# EAGLE schematic Bottom PCB Schematic (EAGLE 9.7.0)
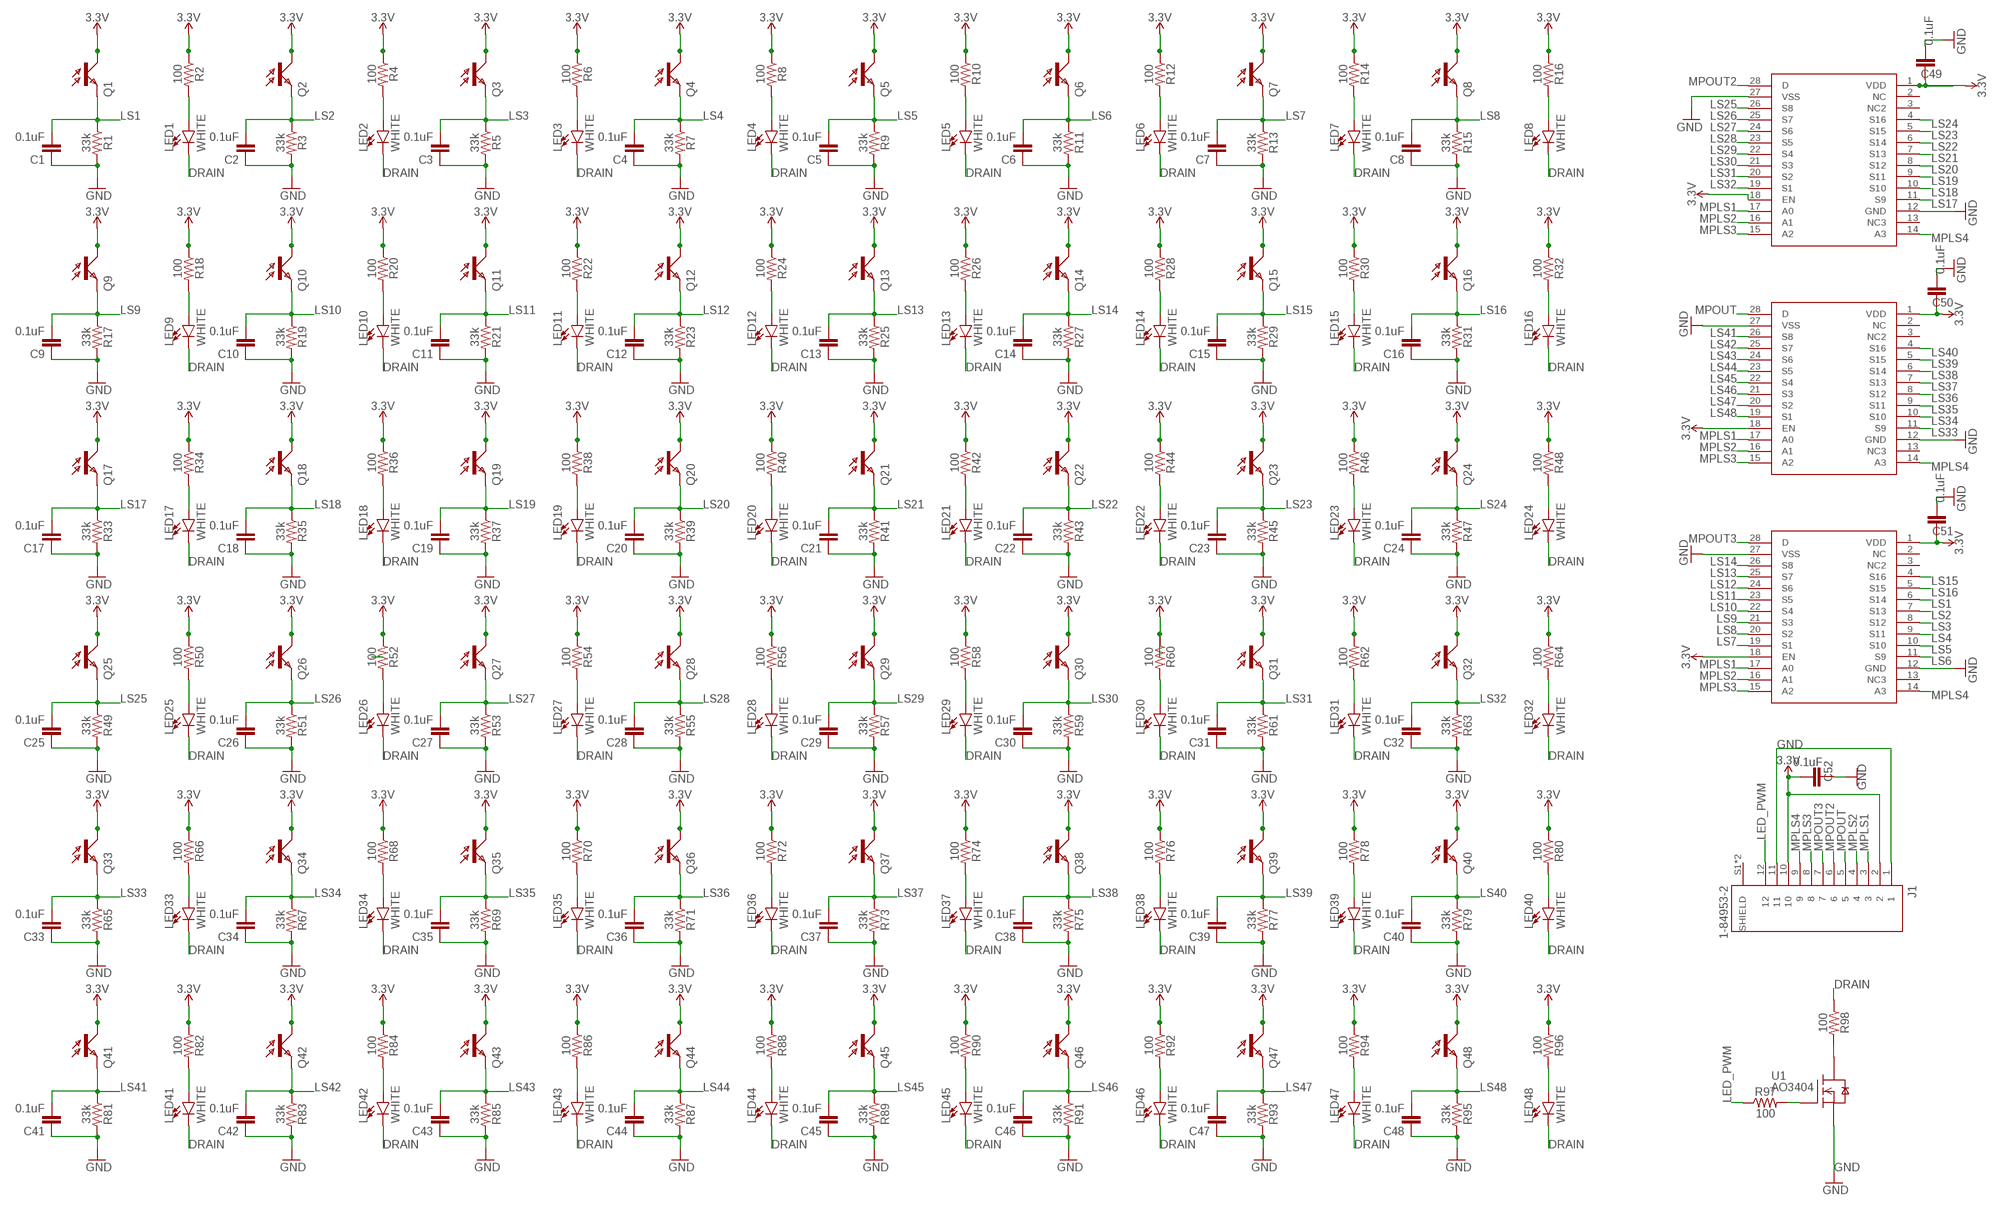
[diagram p0: schematic, sheet 1]

## Parts
C1  0.1uF  0.8PF-0402-50V-0.1PF  [0402]
C2  0.1uF  0.8PF-0402-50V-0.1PF  [0402]
C3  0.1uF  0.8PF-0402-50V-0.1PF  [0402]
C4  0.1uF  0.8PF-0402-50V-0.1PF  [0402]
C5  0.1uF  0.8PF-0402-50V-0.1PF  [0402]
C6  0.1uF  0.8PF-0402-50V-0.1PF  [0402]
C7  0.1uF  0.8PF-0402-50V-0.1PF  [0402]
C8  0.1uF  0.8PF-0402-50V-0.1PF  [0402]
C9  0.1uF  0.8PF-0402-50V-0.1PF  [0402]
C10  0.1uF  0.8PF-0402-50V-0.1PF  [0402]
C11  0.1uF  0.8PF-0402-50V-0.1PF  [0402]
C12  0.1uF  0.8PF-0402-50V-0.1PF  [0402]
C13  0.1uF  0.8PF-0402-50V-0.1PF  [0402]
C14  0.1uF  0.8PF-0402-50V-0.1PF  [0402]
C15  0.1uF  0.8PF-0402-50V-0.1PF  [0402]
C16  0.1uF  0.8PF-0402-50V-0.1PF  [0402]
C17  0.1uF  0.8PF-0402-50V-0.1PF  [0402]
C18  0.1uF  0.8PF-0402-50V-0.1PF  [0402]
C19  0.1uF  0.8PF-0402-50V-0.1PF  [0402]
C20  0.1uF  0.8PF-0402-50V-0.1PF  [0402]
C21  0.1uF  0.8PF-0402-50V-0.1PF  [0402]
C22  0.1uF  0.8PF-0402-50V-0.1PF  [0402]
C23  0.1uF  0.8PF-0402-50V-0.1PF  [0402]
C24  0.1uF  0.8PF-0402-50V-0.1PF  [0402]
C25  0.1uF  0.8PF-0402-50V-0.1PF  [0402]
C26  0.1uF  0.8PF-0402-50V-0.1PF  [0402]
C27  0.1uF  0.8PF-0402-50V-0.1PF  [0402]
C28  0.1uF  0.8PF-0402-50V-0.1PF  [0402]
C29  0.1uF  0.8PF-0402-50V-0.1PF  [0402]
C30  0.1uF  0.8PF-0402-50V-0.1PF  [0402]
C31  0.1uF  0.8PF-0402-50V-0.1PF  [0402]
C32  0.1uF  0.8PF-0402-50V-0.1PF  [0402]
C33  0.1uF  0.8PF-0402-50V-0.1PF  [0402]
C34  0.1uF  0.8PF-0402-50V-0.1PF  [0402]
C35  0.1uF  0.8PF-0402-50V-0.1PF  [0402]
C36  0.1uF  0.8PF-0402-50V-0.1PF  [0402]
C37  0.1uF  0.8PF-0402-50V-0.1PF  [0402]
C38  0.1uF  0.8PF-0402-50V-0.1PF  [0402]
C39  0.1uF  0.8PF-0402-50V-0.1PF  [0402]
C40  0.1uF  0.8PF-0402-50V-0.1PF  [0402]
C41  0.1uF  0.8PF-0402-50V-0.1PF  [0402]
C42  0.1uF  0.8PF-0402-50V-0.1PF  [0402]
C43  0.1uF  0.8PF-0402-50V-0.1PF  [0402]
C44  0.1uF  0.8PF-0402-50V-0.1PF  [0402]
C45  0.1uF  0.8PF-0402-50V-0.1PF  [0402]
C46  0.1uF  0.8PF-0402-50V-0.1PF  [0402]
C47  0.1uF  0.8PF-0402-50V-0.1PF  [0402]
C48  0.1uF  0.8PF-0402-50V-0.1PF  [0402]
C49  0.1uF  0.8PF-0402-50V-0.1PF  [0402]
C50  0.1uF  0.8PF-0402-50V-0.1PF  [0402]
C51  0.1uF  0.8PF-0402-50V-0.1PF  [0402]
C52  0.1uF  0.8PF-0402-50V-0.1PF  [0402]
J1  1-84953-2  [TE_1-84953-2]
LED1  WHITE  LED-RED0603  [LED-0603]
LED2  WHITE  LED-RED0603  [LED-0603]
LED3  WHITE  LED-RED0603  [LED-0603]
LED4  WHITE  LED-RED0603  [LED-0603]
LED5  WHITE  LED-RED0603  [LED-0603]
LED6  WHITE  LED-RED0603  [LED-0603]
LED7  WHITE  LED-RED0603  [LED-0603]
LED8  WHITE  LED-RED0603  [LED-0603]
LED9  WHITE  LED-RED0603  [LED-0603]
LED10  WHITE  LED-RED0603  [LED-0603]
LED11  WHITE  LED-RED0603  [LED-0603]
LED12  WHITE  LED-RED0603  [LED-0603]
LED13  WHITE  LED-RED0603  [LED-0603]
LED14  WHITE  LED-RED0603  [LED-0603]
LED15  WHITE  LED-RED0603  [LED-0603]
LED16  WHITE  LED-RED0603  [LED-0603]
LED17  WHITE  LED-RED0603  [LED-0603]
LED18  WHITE  LED-RED0603  [LED-0603]
LED19  WHITE  LED-RED0603  [LED-0603]
LED20  WHITE  LED-RED0603  [LED-0603]
LED21  WHITE  LED-RED0603  [LED-0603]
LED22  WHITE  LED-RED0603  [LED-0603]
LED23  WHITE  LED-RED0603  [LED-0603]
LED24  WHITE  LED-RED0603  [LED-0603]
LED25  WHITE  LED-RED0603  [LED-0603]
LED26  WHITE  LED-RED0603  [LED-0603]
LED27  WHITE  LED-RED0603  [LED-0603]
LED28  WHITE  LED-RED0603  [LED-0603]
LED29  WHITE  LED-RED0603  [LED-0603]
LED30  WHITE  LED-RED0603  [LED-0603]
LED31  WHITE  LED-RED0603  [LED-0603]
LED32  WHITE  LED-RED0603  [LED-0603]
LED33  WHITE  LED-RED0603  [LED-0603]
LED34  WHITE  LED-RED0603  [LED-0603]
LED35  WHITE  LED-RED0603  [LED-0603]
LED36  WHITE  LED-RED0603  [LED-0603]
LED37  WHITE  LED-RED0603  [LED-0603]
LED38  WHITE  LED-RED0603  [LED-0603]
LED39  WHITE  LED-RED0603  [LED-0603]
LED40  WHITE  LED-RED0603  [LED-0603]
LED41  WHITE  LED-RED0603  [LED-0603]
LED42  WHITE  LED-RED0603  [LED-0603]
LED43  WHITE  LED-RED0603  [LED-0603]
LED44  WHITE  LED-RED0603  [LED-0603]
LED45  WHITE  LED-RED0603  [LED-0603]
LED46  WHITE  LED-RED0603  [LED-0603]
LED47  WHITE  LED-RED0603  [LED-0603]
LED48  WHITE  LED-RED0603  [LED-0603]
MUX1  MUX506  [28-TSSOP]
MUX2  MUX506  [28-TSSOP]
MUX3  MUX506  [28-TSSOP]
Q1  ALS  [SMD]
Q2  ALS  [SMD]
Q3  ALS  [SMD]
Q4  ALS  [SMD]
Q5  ALS  [SMD]
Q6  ALS  [SMD]
Q7  ALS  [SMD]
Q8  ALS  [SMD]
Q9  ALS  [SMD]
Q10  ALS  [SMD]
Q11  ALS  [SMD]
Q12  ALS  [SMD]
Q13  ALS  [SMD]
Q14  ALS  [SMD]
Q15  ALS  [SMD]
Q16  ALS  [SMD]
Q17  ALS  [SMD]
Q18  ALS  [SMD]
Q19  ALS  [SMD]
Q20  ALS  [SMD]
Q21  ALS  [SMD]
Q22  ALS  [SMD]
Q23  ALS  [SMD]
Q24  ALS  [SMD]
Q25  ALS  [SMD]
Q26  ALS  [SMD]
Q27  ALS  [SMD]
Q28  ALS  [SMD]
Q29  ALS  [SMD]
Q30  ALS  [SMD]
Q31  ALS  [SMD]
Q32  ALS  [SMD]
Q33  ALS  [SMD]
Q34  ALS  [SMD]
Q35  ALS  [SMD]
Q36  ALS  [SMD]
Q37  ALS  [SMD]
Q38  ALS  [SMD]
Q39  ALS  [SMD]
Q40  ALS  [SMD]
Q41  ALS  [SMD]
Q42  ALS  [SMD]
Q43  ALS  [SMD]
Q44  ALS  [SMD]
Q45  ALS  [SMD]
Q46  ALS  [SMD]
Q47  ALS  [SMD]
Q48  ALS  [SMD]
R1  33k  RESISTOR0603  [0603]
R2  100  RESISTOR0603  [0603]
R3  33k  RESISTOR0603  [0603]
R4  100  RESISTOR0603  [0603]
R5  33k  RESISTOR0603  [0603]
R6  100  RESISTOR0603  [0603]
R7  33k  RESISTOR0603  [0603]
R8  100  RESISTOR0603  [0603]
R9  33k  RESISTOR0603  [0603]
R10  100  RESISTOR0603  [0603]
R11  33k  RESISTOR0603  [0603]
R12  100  RESISTOR0603  [0603]
R13  33k  RESISTOR0603  [0603]
R14  100  RESISTOR0603  [0603]
R15  33k  RESISTOR0603  [0603]
R16  100  RESISTOR0603  [0603]
R17  33k  RESISTOR0603  [0603]
R18  100  RESISTOR0603  [0603]
R19  33k  RESISTOR0603  [0603]
R20  100  RESISTOR0603  [0603]
R21  33k  RESISTOR0603  [0603]
R22  100  RESISTOR0603  [0603]
R23  33k  RESISTOR0603  [0603]
R24  100  RESISTOR0603  [0603]
R25  33k  RESISTOR0603  [0603]
R26  100  RESISTOR0603  [0603]
R27  33k  RESISTOR0603  [0603]
R28  100  RESISTOR0603  [0603]
R29  33k  RESISTOR0603  [0603]
R30  100  RESISTOR0603  [0603]
R31  33k  RESISTOR0603  [0603]
R32  100  RESISTOR0603  [0603]
R33  33k  RESISTOR0603  [0603]
R34  100  RESISTOR0603  [0603]
R35  33k  RESISTOR0603  [0603]
R36  100  RESISTOR0603  [0603]
R37  33k  RESISTOR0603  [0603]
R38  100  RESISTOR0603  [0603]
R39  33k  RESISTOR0603  [0603]
R40  100  RESISTOR0603  [0603]
R41  33k  RESISTOR0603  [0603]
R42  100  RESISTOR0603  [0603]
R43  33k  RESISTOR0603  [0603]
R44  100  RESISTOR0603  [0603]
R45  33k  RESISTOR0603  [0603]
R46  100  RESISTOR0603  [0603]
R47  33k  RESISTOR0603  [0603]
R48  100  RESISTOR0603  [0603]
R49  33k  RESISTOR0603  [0603]
R50  100  RESISTOR0603  [0603]
R51  33k  RESISTOR0603  [0603]
R52  100  RESISTOR0603  [0603]
R53  33k  RESISTOR0603  [0603]
R54  100  RESISTOR0603  [0603]
R55  33k  RESISTOR0603  [0603]
R56  100  RESISTOR0603  [0603]
R57  33k  RESISTOR0603  [0603]
R58  100  RESISTOR0603  [0603]
R59  33k  RESISTOR0603  [0603]
R60  100  RESISTOR0603  [0603]
R61  33k  RESISTOR0603  [0603]
R62  100  RESISTOR0603  [0603]
R63  33k  RESISTOR0603  [0603]
R64  100  RESISTOR0603  [0603]
R65  33k  RESISTOR0603  [0603]
R66  100  RESISTOR0603  [0603]
R67  33k  RESISTOR0603  [0603]
R68  100  RESISTOR0603  [0603]
R69  33k  RESISTOR0603  [0603]
R70  100  RESISTOR0603  [0603]
R71  33k  RESISTOR0603  [0603]
R72  100  RESISTOR0603  [0603]
R73  33k  RESISTOR0603  [0603]
R74  100  RESISTOR0603  [0603]
R75  33k  RESISTOR0603  [0603]
R76  100  RESISTOR0603  [0603]
R77  33k  RESISTOR0603  [0603]
R78  100  RESISTOR0603  [0603]
R79  33k  RESISTOR0603  [0603]
R80  100  RESISTOR0603  [0603]
R81  33k  RESISTOR0603  [0603]
R82  100  RESISTOR0603  [0603]
R83  33k  RESISTOR0603  [0603]
R84  100  RESISTOR0603  [0603]
R85  33k  RESISTOR0603  [0603]
R86  100  RESISTOR0603  [0603]
R87  33k  RESISTOR0603  [0603]
R88  100  RESISTOR0603  [0603]
R89  33k  RESISTOR0603  [0603]
R90  100  RESISTOR0603  [0603]
R91  33k  RESISTOR0603  [0603]
R92  100  RESISTOR0603  [0603]
R93  33k  RESISTOR0603  [0603]
R94  100  RESISTOR0603  [0603]
R95  33k  RESISTOR0603  [0603]
R96  100  RESISTOR0603  [0603]
R97  100  RESISTOR0603  [0603]
R98  100  RESISTOR0603  [0603]
U1  AO3404  [SOT23-3]

## Nets
3.3V: C49.1 C50.1 C51.1 C52.2 J1.2 J1.10 MUX1.1(VDD) MUX1.18(EN) MUX2.1(VDD) MUX2.18(EN) MUX3.1(VDD) MUX3.18(EN) Q1.C Q2.C Q3.C Q4.C Q5.C Q6.C Q7.C Q8.C Q9.C Q10.C Q11.C Q12.C Q13.C Q14.C Q15.C Q16.C Q17.C Q18.C Q19.C Q20.C Q21.C Q22.C Q23.C Q24.C Q25.C Q26.C Q27.C Q28.C Q29.C Q30.C Q31.C Q32.C Q33.C Q34.C Q35.C Q36.C Q37.C Q38.C Q39.C Q40.C Q41.C Q42.C Q43.C Q44.C Q45.C Q46.C Q47.C Q48.C R2.1 R4.1 R6.1 R8.1 R10.1 R12.1 R14.1 R16.1 R18.1 R20.1 R22.1 R24.1 R26.1 R28.1 R30.1 R32.1 R34.1 R36.1 R38.1 R40.1 R42.1 R44.1 R46.1 R48.1 R50.1 R52.1 R54.1 R56.1 R58.1 R60.1 R62.1 R64.1 R66.1 R68.1 R70.1 R72.1 R74.1 R76.1 R78.1 R80.1 R82.1 R84.1 R86.1 R88.1 R90.1 R92.1 R94.1 R96.1
DRAIN: LED1.C LED2.C LED3.C LED4.C LED5.C LED6.C LED7.C LED8.C LED9.C LED10.C LED11.C LED12.C LED13.C LED14.C LED15.C LED16.C LED17.C LED18.C LED19.C LED20.C LED21.C LED22.C LED23.C LED24.C LED25.C LED26.C LED27.C LED28.C LED29.C LED30.C LED31.C LED32.C LED33.C LED34.C LED35.C LED36.C LED37.C LED38.C LED39.C LED40.C LED41.C LED42.C LED43.C LED44.C LED45.C LED46.C LED47.C LED48.C R98.1
GND: C1.1 C2.1 C3.1 C4.1 C5.1 C6.1 C7.1 C8.1 C9.1 C10.1 C11.1 C12.1 C13.1 C14.1 C15.1 C16.1 C17.1 C18.1 C19.1 C20.1 C21.1 C22.1 C23.1 C24.1 C25.1 C26.1 C27.1 C28.1 C29.1 C30.1 C31.1 C32.1 C33.1 C34.1 C35.1 C36.1 C37.1 C38.1 C39.1 C40.1 C41.1 C42.1 C43.1 C44.1 C45.1 C46.1 C47.1 C48.1 C49.2 C50.2 C51.2 C52.1 J1.1 J1.11 MUX1.12(GND) MUX1.27(VSS) MUX2.12(GND) MUX2.27(VSS) MUX3.12(GND) MUX3.27(VSS) R1.2 R3.2 R5.2 R7.2 R9.2 R11.2 R13.2 R15.2 R17.2 R19.2 R21.2 R23.2 R25.2 R27.2 R29.2 R31.2 R33.2 R35.2 R37.2 R39.2 R41.2 R43.2 R45.2 R47.2 R49.2 R51.2 R53.2 R55.2 R57.2 R59.2 R61.2 R63.2 R65.2 R67.2 R69.2 R71.2 R73.2 R75.2 R77.2 R79.2 R81.2 R83.2 R85.2 R87.2 R89.2 R91.2 R93.2 R95.2 U1.2(S)
LED_PWM: J1.12 R97.1
LS1: C1.2 MUX3.6(S14) Q1.E R1.1
LS2: C2.2 MUX3.7(S13) Q2.E R3.1
LS3: C3.2 MUX3.8(S12) Q3.E R5.1
LS4: C4.2 MUX3.9(S11) Q4.E R7.1
LS5: C5.2 MUX3.10(S10) Q5.E R9.1
LS6: C6.2 MUX3.11(S9) Q6.E R11.1
LS7: C7.2 MUX3.19(S1) Q7.E R13.1
LS8: C8.2 MUX3.20(S2) Q8.E R15.1
LS9: C9.2 MUX3.21(S3) Q9.E R17.1
LS10: C10.2 MUX3.22(S4) Q10.E R19.1
LS11: C11.2 MUX3.23(S5) Q11.E R21.1
LS12: C12.2 MUX3.24(S6) Q12.E R23.1
LS13: C13.2 MUX3.25(S7) Q13.E R25.1
LS14: C14.2 MUX3.26(S8) Q14.E R27.1
LS15: C15.2 MUX3.4(S16) Q15.E R29.1
LS16: C16.2 MUX3.5(S15) Q16.E R31.1
LS17: C17.2 MUX1.11(S9) Q17.E R33.1
LS18: C18.2 MUX1.10(S10) Q18.E R35.1
LS19: C19.2 MUX1.9(S11) Q19.E R37.1
LS20: C20.2 MUX1.8(S12) Q20.E R39.1
LS21: C21.2 MUX1.7(S13) Q21.E R41.1
LS22: C22.2 MUX1.6(S14) Q22.E R43.1
LS23: C23.2 MUX1.5(S15) Q23.E R45.1
LS24: C24.2 MUX1.4(S16) Q24.E R47.1
LS25: C25.2 MUX1.26(S8) Q25.E R49.1
LS26: C26.2 MUX1.25(S7) Q26.E R51.1
LS27: C27.2 MUX1.24(S6) Q27.E R53.1
LS28: C28.2 MUX1.23(S5) Q28.E R55.1
LS29: C29.2 MUX1.22(S4) Q29.E R57.1
LS30: C30.2 MUX1.21(S3) Q30.E R59.1
LS31: C31.2 MUX1.20(S2) Q31.E R61.1
LS32: C32.2 MUX1.19(S1) Q32.E R63.1
LS33: C33.2 MUX2.11(S9) Q33.E R65.1
LS34: C34.2 MUX2.10(S10) Q34.E R67.1
LS35: C35.2 MUX2.9(S11) Q35.E R69.1
LS36: C36.2 MUX2.8(S12) Q36.E R71.1
LS37: C37.2 MUX2.7(S13) Q37.E R73.1
LS38: C38.2 MUX2.6(S14) Q38.E R75.1
LS39: C39.2 MUX2.5(S15) Q39.E R77.1
LS40: C40.2 MUX2.4(S16) Q40.E R79.1
LS41: C41.2 MUX2.26(S8) Q41.E R81.1
LS42: C42.2 MUX2.25(S7) Q42.E R83.1
LS43: C43.2 MUX2.24(S6) Q43.E R85.1
LS44: C44.2 MUX2.23(S5) Q44.E R87.1
LS45: C45.2 MUX2.22(S4) Q45.E R89.1
LS46: C46.2 MUX2.21(S3) Q46.E R91.1
LS47: C47.2 MUX2.20(S2) Q47.E R93.1
LS48: C48.2 MUX2.19(S1) Q48.E R95.1
MPLS1: J1.3 MUX1.17(A0) MUX2.17(A0) MUX3.17(A0)
MPLS2: J1.4 MUX1.16(A1) MUX2.16(A1) MUX3.16(A1)
MPLS3: J1.8 MUX1.15(A2) MUX2.15(A2) MUX3.15(A2)
MPLS4: J1.9 MUX1.14(A3) MUX2.14(A3) MUX3.14(A3)
MPOUT: J1.5 MUX2.28(D)
MPOUT2: J1.6 MUX1.28(D)
MPOUT3: J1.7 MUX3.28(D)
N$1: LED2.A R4.2
N$2: LED3.A R6.2
N$3: LED4.A R8.2
N$4: LED5.A R10.2
N$5: LED6.A R12.2
N$6: LED7.A R14.2
N$7: LED8.A R16.2
N$8: LED9.A R18.2
N$9: LED10.A R20.2
N$10: LED11.A R22.2
N$11: LED12.A R24.2
N$12: LED13.A R26.2
N$13: LED14.A R28.2
N$14: LED15.A R30.2
N$15: LED16.A R32.2
N$16: LED17.A R34.2
N$17: LED18.A R36.2
N$18: LED19.A R38.2
N$19: LED20.A R40.2
N$20: LED21.A R42.2
N$21: LED22.A R44.2
N$22: LED23.A R46.2
N$23: LED24.A R48.2
N$24: LED25.A R50.2
N$25: LED26.A R52.2
N$26: LED27.A R54.2
N$27: LED28.A R56.2
N$28: LED29.A R58.2
N$29: LED30.A R60.2
N$30: LED31.A R62.2
N$31: LED1.A R2.2
N$32: LED32.A R64.2
N$33: LED33.A R66.2
N$34: LED34.A R68.2
N$35: LED35.A R70.2
N$36: LED36.A R72.2
N$37: LED37.A R74.2
N$38: LED38.A R76.2
N$39: LED39.A R78.2
N$40: LED40.A R80.2
N$41: LED41.A R82.2
N$42: LED42.A R84.2
N$43: LED43.A R86.2
N$44: LED44.A R88.2
N$45: LED45.A R90.2
N$46: LED46.A R92.2
N$47: LED47.A R94.2
N$48: LED48.A R96.2
N$53: R97.2 U1.1(G)
N$54: R98.2 U1.3(D)
Unconnected: J1.S1(SHIELD) J1.S2(SHIELD) MUX1.2(NC) MUX1.3(NC2) MUX1.13(NC3) MUX2.2(NC) MUX2.3(NC2) MUX2.13(NC3) MUX3.2(NC) MUX3.3(NC2) MUX3.13(NC3)

## Library data of the parts
C1-C52 = SparkFun-Capacitors:0.8PF: 0.8pF ceramic capacitors A capacitor is a passive two-terminal electrical component used to store electrical energy temporarily in an electric field.
J1 = real 12p ffc connector:1-84953-2
LED1-LED48 = SparkFun-LED:LED-RED: Red SMD LED Used in manufacturing of most products at SparkFun Packages: 0603 - SMD 0603 package [Product Link] <http://docs.avagotech.com/docs/AV02-0551EN> 0603 SMART - SMD 0603 SMART package ( more efficient and expensive)[Product Link] <http://www.osram-os.com/Graphics/XPic2/00077099_0.pdf> 1206 - SMD1206 package [Product Link] <https://www.sparkfun.com/datasheets/DevTools/LilyPad/Q150OVS4.pdff> SparkFun Products: Pro Mini 328 -5V <https://www.sparkfun.com/products/821> RedBoard <https://www.sparkfun.com/products/12757> IOIO-OTG <https://www.sparkfun.com/products/13613>
MUX1-MUX3 = MUX:MUX506
Q1-Q48 = phototransitor-ALS-PT19-315CL177TR8:ALS
R1-R98 = SparkFun-Resistors:RESISTOR: Generic Resistor Package
U1 = AO3404:AO3404: Check availability <https://pricing.snapeda.com/parts/AO3404/Alpha%20%26%20Omega%20Semiconductor%20Inc./view-part?ref=eda>